# Altium schematic sheet Ukl_sterowania.SchDoc
size A4; SheetNumber: 4; SheetTotal: 8; SPICEModelCacheXNHIIHBZ: <root> / <DocumentId>XNHIIHBZ</DocumentId> / </root>
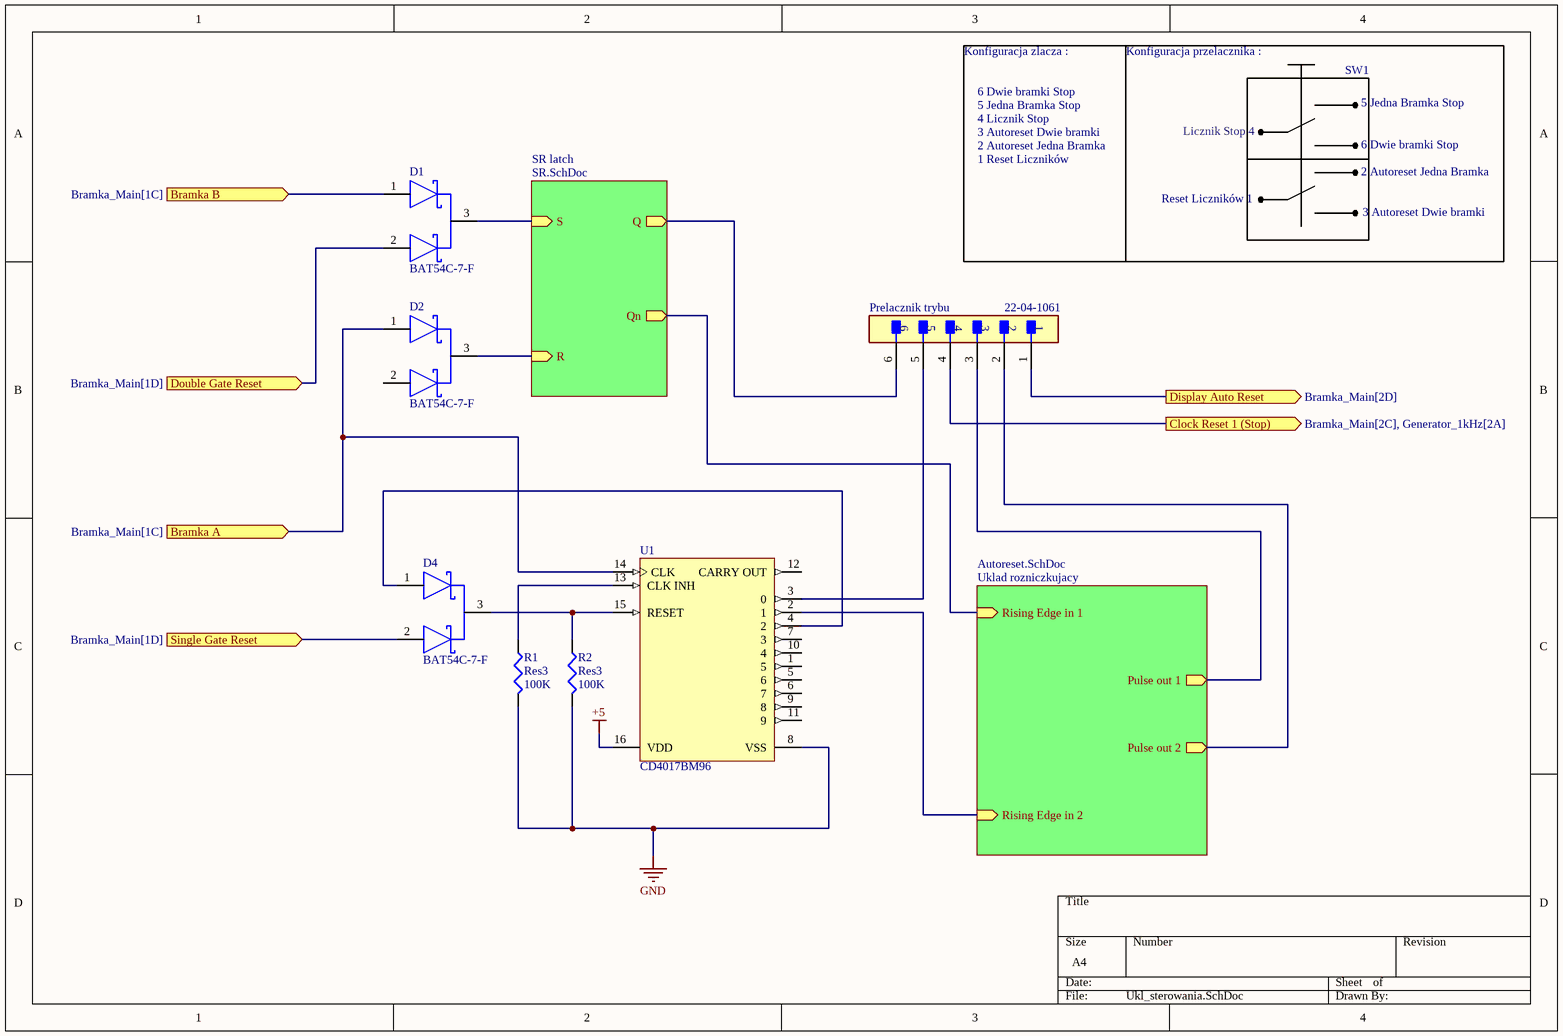
[diagram p0: Ukl_sterowania.SchDoc]

## Parts
D1  BAT54C-7-F  [FP-SOT23-IPC_B]
D2  BAT54C-7-F  [FP-SOT23-IPC_B]
D4  BAT54C-7-F  [FP-SOT23-IPC_B]
Prelacznik_trybu  22-04-1061  [FP-22-04-1061-MFG]
R1  Res3  value 100K  [J1-0603]
R2  Res3  value 100K  [J1-0603]
U1  CD4017BM96  [D0016A_L]

## Sub-sheets
SR latch = SR.SchDoc: S (in), R (in), Q (out), Qn (out)
Uklad rozniczkujacy = Autoreset.SchDoc: Rising Edge in 1 (in), Rising Edge in 2 (in), Pulse out 1 (out), Pulse out 2 (out)

## Ports
Bramka A (in, see Bramka_Main[1C]), Bramka B (in, see Bramka_Main[1C]), Clock Reset 1 (Stop) (out, see Bramka_Main[2C], Generator_1kHz[2A]), Display Auto Reset (out, see Bramka_Main[2D]), Double Gate Reset (in, see Bramka_Main[1D]), Single Gate Reset (in, see Bramka_Main[1D])

## Nets
+5: U1.16(VDD)
GND: R1.2 R2.2 U1.8(VSS)
Bramka A: D2.1(1_ANODE) U1.14(CLK) ; port Bramka A
Bramka B: D1.1(1_ANODE) ; port Bramka B
Clock Reset 1 (Stop): Prelacznik_trybu.4 ; port Clock Reset 1 (Stop)
Display Auto Reset: Prelacznik_trybu.1 ; port Display Auto Reset
Double Gate Reset: D1.2(2_ANODE) ; port Double Gate Reset
Single Gate Reset: D4.2(2_ANODE) ; port Single Gate Reset
NetD1_3: D1.3(COMMON_CATHODE) ; sheet SR latch/S
NetD2_3: D2.3(COMMON_CATHODE) ; sheet SR latch/R
NetD4_1: D4.1(1_ANODE) U1.4(2)
NetD4_3: D4.3(COMMON_CATHODE) R2.1 U1.15(RESET)
NetPrelacznik_trybu_2: Prelacznik_trybu.2 ; sheet Uklad rozniczkujacy/Pulse out 2
NetPrelacznik_trybu_3: Prelacznik_trybu.3 ; sheet Uklad rozniczkujacy/Pulse out 1
NetPrelacznik_trybu_5: Prelacznik_trybu.5 U1.3(0)
NetPrelacznik_trybu_6: Prelacznik_trybu.6 ; sheet SR latch/Q
NetR1_1: R1.1 U1.13(CLK_INH)
NetU1_2: U1.2(1) ; sheet Uklad rozniczkujacy/Rising Edge in 2
(unnamed): sheet SR latch/Qn, sheet Uklad rozniczkujacy/Rising Edge in 1

Not connected (* = marked no-connect by the designer): D2 2(2_ANODE); U1 1(5) 5(6) 6(7) 7(3) 9(8) 10(4) 11(9) 12(CARRY_OUT)

## Notes on the sheet
- Konfiguracja zlacza :
- 6 Dwie bramki Stop
- 5 Jedna Bramka Stop
- Konfiguracja przelacznika :
- SW1
- 4 Licznik Stop
- 3 Autoreset Dwie bramki
- 2 Autoreset Jedna Bramka
- 1 Reset Liczników
- Licznik Stop 4
- Reset Liczników 1

## Library data of the parts
D1 D2 D4 = CMP-12790-000084-1: DIODE ARRAY SCHOTTKY 30V SOT23-3; Max Reverse Current: 2uA; Power Dissipation: 200mW; Average Rectified Current: 200mA; Capacitance: 10pF; Peak Non-Repetitive Surge Current: 600mA; Forward Voltage: 800mV; Reverse Recovery Time: 5ns; Element Configuration: Common Cathode; Max Operating Temperature: 150°C; Max Reverse Voltage (DC): 30V; Power Rating: 200mW; Termination: SMD/SMT; REACH SVHC: No SVHC; Voltage Rating (DC): 30V; Series: -; Current Rating: 200mA; RoHS Compliant: Yes; Max Power Dissipation: 200mW; Case/Package: SOT-23; Max Repetitive Reverse Voltage (Vrrm): 30V; Width: 1.3mm; Min Operating Temperature: -65°C; Lead Free: Lead Free; Forward Current: 200mA; Number of Pins: 3; Contact Plating: Tin; Package Quantity: 3000; Length: 2.9mm; Radiation Hardening: No; Max Forward Surge Current (Ifsm): 600mA; Height: 1mm; Packaging: Tape and Reel; Mount: Surface Mount; Weight: 0.000282oz
Prelacznik_trybu = CMP-04776-000934-1: CONN HEADER VERT 6POS 2.5MM; Number of Positions: 6; Contact Resistance: 20mR; Insulation Resistance: 1GR; Glow Wire Compliant: Non-compliant; Current Rating: 3A; Max Voltage Rating (DC): 250.25kV; Voltage Rating (AC): 250V; Connector Type: Male Pin; Gender: Male; Hole Diameter: 1.19mm; Termination: Solder; Number of Circuits: 6; Number of Rows: 1; Mount: Through Hole; Lead Free: Lead Free; Contact Type: Male Pin; Lead Pitch: 2.5mm; Radiation Hardening: No; Packaging: Bulk; Pitch: 2.5mm; Contact Plating: Tin; Housing Color: Natural; Fastening Type: Friction; Contact Gender: Male; Length: 14.5mm; Orientation: Straight; Series: KK® 5045; Number of Contacts: 6; Halogen Free: Low Halogen; Min Operating Temperature: -40°C; Number of Poles: 6; Width: 5.8mm; Housing Material: Nylon; Max Operating Temperature: 105°C; Contact Material: Brass; Flammability Rating: UL94 V-0; Color: Natural; Contact Mating Length: 0.295inch; Working Voltage: 250V; Voltage Rating: 250V; Package Quantity: 1; Height: 11.7mm; Voltage Rating (DC): 250V
R1 R2 = Res3: Resistor; Published: 8-Jun-2000; LatestRevisionDate: 29-May-2009; LatestRevisionNote: IPC-7351 Footprint Added.; PackageReference: J1-0603; Publisher: Altium Limited; PackageDescription: Chip Resistor
U1 = CMP-1623-00072-2: CMOS Decade Counter with 10 Decoded Outputs, D0016A, LARGE T&R; Manufacturer: Texas Instruments; Technology Family: CD4000; Schmitt Trigger: No; VCC(Max)(V): 18; Inputs: 1; tpd @ Nom Voltage(Max)(ns): 270; Rating: Military; Bits(#): 10; Output Drive (IOL/IOH)(Max)(mA): 1.5/-1.5; ICC @ Nom Voltage(Max)(mA): 0.03; F @ Nom Voltage(Max)(Mhz): 8; VCC(Min)(V): 3; Output Type: CMOS; Operating Temperature Range(C): -55 to 125; Generic Part Number: CD4017B; Type: Decade; DatasheetVersion: SCHS027C; Input Type: CMOS; Function: Counter; PackageReference: D0016A; Code_JEDEC: MS-012 variation AC; Voltage(Nom)(V): 10